# Altium project A540R260_PGA_ARM3_FPA.PrjPcb
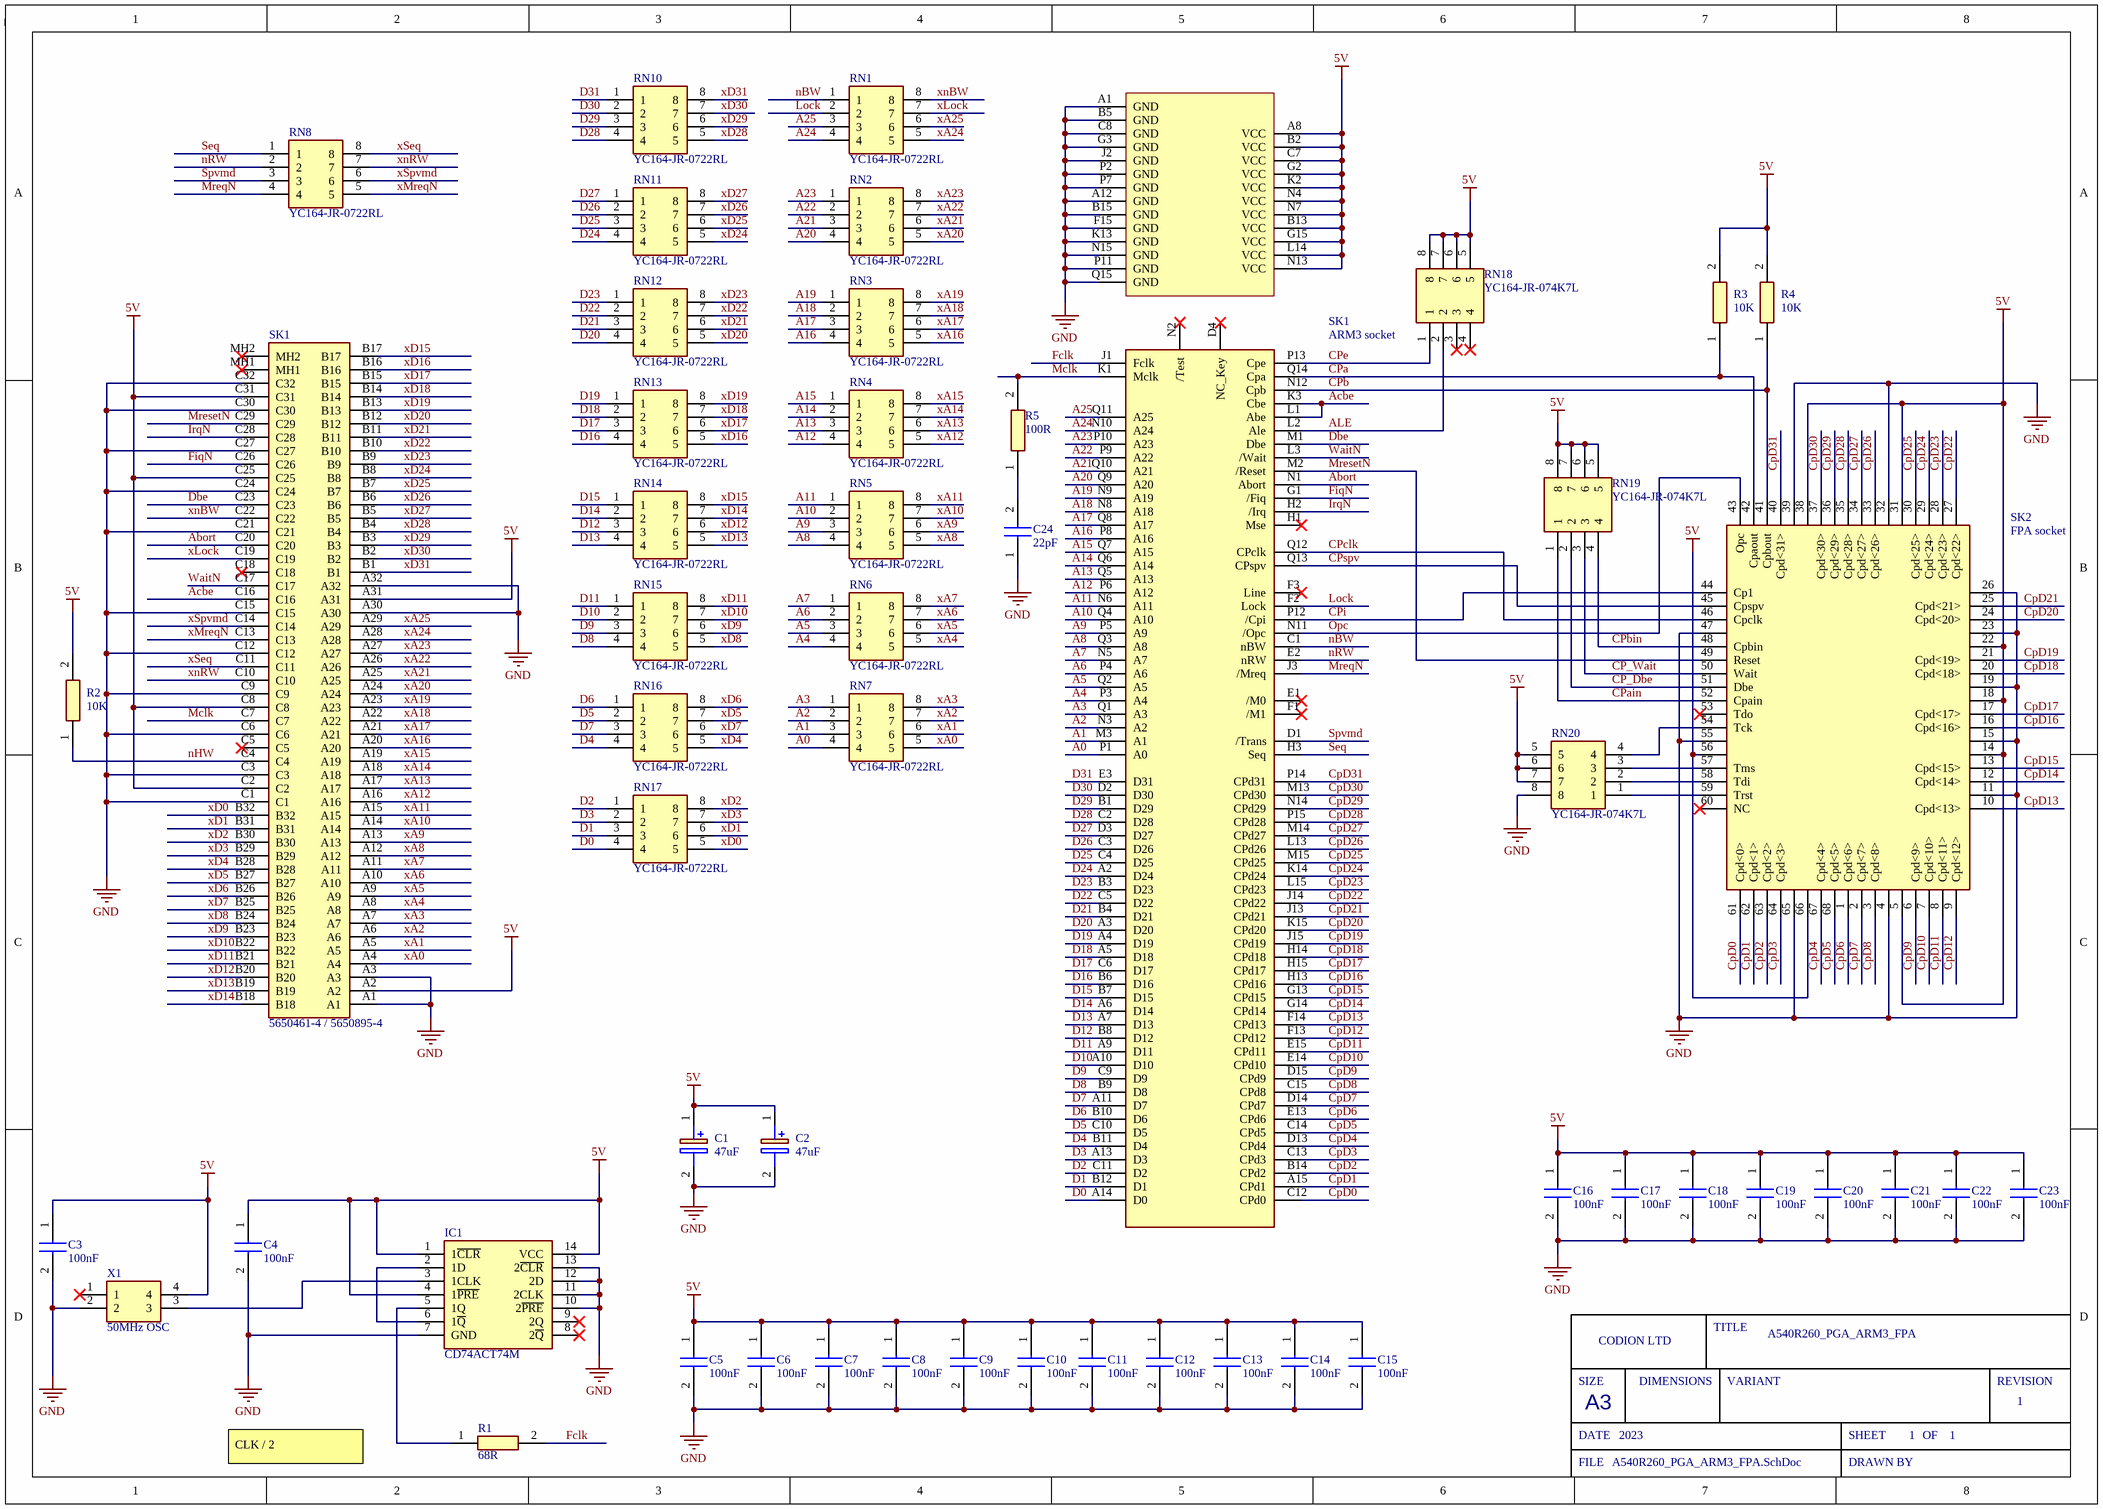
[diagram p0: A540R260_PGA_ARM3_FPA.SchDoc]
Project_Title: A540R260_PGA_ARM3_FPA; Sch_ReleaseDate: 2023; Sch_RevNo: 1
1 sheet, 53 parts. Net scope: global (net labels, ports and power ports of the same name join across sheets).
Board file: A540R260_PGA_ARM3_FPA.PcbDoc

## Sheet A540R260_PGA_ARM3_FPA.SchDoc
size A3; SheetNumber: 1; SheetTotal: 1

### Parts
(Parts that share a designator on the sheet are numbered #1, #2 ... from top to bottom, then left to right.)
C1  47uF  [EEE1AA101SP]
C2  47uF  [EEE1AA101SP]
C3  100nF  [CAPC2012X145N]
C4  100nF  [CAPC2012X145N]
C5  100nF  [CAPC2012X145N]
C6  100nF  [CAPC2012X145N]
C7  100nF  [CAPC2012X145N]
C8  100nF  [CAPC2012X145N]
C9  100nF  [CAPC2012X145N]
C10  100nF  [CAPC2012X145N]
C11  100nF  [CAPC2012X145N]
C12  100nF  [CAPC2012X145N]
C13  100nF  [CAPC2012X145N]
C14  100nF  [CAPC2012X145N]
C15  100nF  [CAPC2012X145N]
C16  100nF  [CAPC2012X145N]
C17  100nF  [CAPC2012X145N]
C18  100nF  [CAPC2012X145N]
C19  100nF  [CAPC2012X145N]
C20  100nF  [CAPC2012X145N]
C21  100nF  [CAPC2012X145N]
C22  100nF  [CAPC2012X145N]
C23  100nF  [CAPC2012X145N]
C24  22pF  [CAPC1608X90N]
IC1  CD74ACT74M  [SOIC127P600X175-14N]
R1  value 68R  [RESC2012X50N]  (hidden comment: CRCW080568R0FKEA)
R2  10K  [RESC2012X60N]
R3  10K  [RESC2012X60N]
R4  10K  [RESC2012X60N]
R5  100R  [RESC2012X60N]
RN1  YC164-JR-0722RL  [YC164JR072K2L]
RN2  YC164-JR-0722RL  [YC164JR072K2L]
RN3  YC164-JR-0722RL  [YC164JR072K2L]
RN4  YC164-JR-0722RL  [YC164JR072K2L]
RN5  YC164-JR-0722RL  [YC164JR072K2L]
RN6  YC164-JR-0722RL  [YC164JR072K2L]
RN7  YC164-JR-0722RL  [YC164JR072K2L]
RN8  YC164-JR-0722RL  [YC164JR072K2L]
RN10  YC164-JR-0722RL  [YC164JR072K2L]
RN11  YC164-JR-0722RL  [YC164JR072K2L]
RN12  YC164-JR-0722RL  [YC164JR072K2L]
RN13  YC164-JR-0722RL  [YC164JR072K2L]
RN14  YC164-JR-0722RL  [YC164JR072K2L]
RN15  YC164-JR-0722RL  [YC164JR072K2L]
RN16  YC164-JR-0722RL  [YC164JR072K2L]
RN17  YC164-JR-0722RL  [YC164JR072K2L]
RN18  YC164-JR-074K7L  [YC164JR07220RL]
RN19  YC164-JR-074K7L  [YC164JR07220RL]
RN20  YC164-JR-074K7L  [YC164JR07220RL]
SK1#1  ARM3 socket  [PGA_ARM3]
SK1#2  5650461-4 / 5650895-4  [56504614]
SK2  FPA socket  [MEMC_Socket]
X1  50MHz OSC  [DIPS762W56P1524L1778H241Q4N]

### Nets
5V: C1.1(+) C2.1(+) C3.1 C4.1 C5.1 C6.1 C7.1 C8.1 C9.1 C10.1 C11.1 C12.1 C13.1 C14.1 C15.1 C16.1 C17.1 C18.1 C19.1 C20.1 C21.1 C22.1 C23.1 IC1.1(1~{CLR}) IC1.4(1~{PRE}) IC1.14(VCC) R2.2 R3.2 R4.2 RN18.5 RN18.6 RN18.7 RN18.8 RN19.5 RN19.6 RN19.7 RN19.8 RN20.5 RN20.6 RN20.7 SK1#1.A8(VCC) SK1#1.B2(VCC) SK1#1.B13(VCC) SK1#1.C7(VCC) SK1#1.G2(VCC) SK1#1.G15(VCC) SK1#1.K2(VCC) SK1#1.L14(VCC) SK1#1.N4(VCC) SK1#1.N7(VCC) SK1#1.N13(VCC) SK1#2.A2 SK1#2.A31 SK1#2.C2 SK1#2.C8 SK1#2.C25 SK1#2.C31 SK2.5 SK2.14 SK2.18 SK2.22 SK2.31 SK2.38 SK2.56 SK2.66 X1.4
GND: C1.2(-) C2.2(-) C3.2 C4.2 C5.2 C6.2 C7.2 C8.2 C9.2 C10.2 C11.2 C12.2 C13.2 C14.2 C15.2 C16.2 C17.2 C18.2 C19.2 C20.2 C21.2 C22.2 C23.2 C24.1 IC1.7(GND) IC1.10(2~{PRE}) IC1.11(2CLK) IC1.12(2D) IC1.13(2~{CLR}) RN20.8 SK1#1.A1(GND) SK1#1.A12(GND) SK1#1.B5(GND) SK1#1.B15(GND) SK1#1.C8(GND) SK1#1.F15(GND) SK1#1.G3(GND) SK1#1.J2(GND) SK1#1.K13(GND) SK1#1.N15(GND) SK1#1.P2(GND) SK1#1.P7(GND) SK1#1.P11(GND) SK1#1.Q15(GND) SK1#2.A1 SK1#2.A3 SK1#2.A30 SK1#2.A32 SK1#2.C1 SK1#2.C3 SK1#2.C6 SK1#2.C9 SK1#2.C12 SK1#2.C15 SK1#2.C21 SK1#2.C24 SK1#2.C27 SK1#2.C30 SK1#2.C32 SK2.4 SK2.11 SK2.15 SK2.19 SK2.23 SK2.26 SK2.32 SK2.39 SK2.47 SK2.55 SK2.65 X1.2
A0: RN7.4 SK1#1.P1(A0)
A1: RN7.3 SK1#1.M3(A1)
A2: RN7.2 SK1#1.N3(A2)
A3: RN7.1 SK1#1.Q1(A3)
A4: RN6.4 SK1#1.P3(A4)
A5: RN6.3 SK1#1.Q2(A5)
A6: RN6.2 SK1#1.P4(A6)
A7: RN6.1 SK1#1.N5(A7)
A8: RN5.4 SK1#1.Q3(A8)
A9: RN5.3 SK1#1.P5(A9)
A10: RN5.2 SK1#1.Q4(A10)
A11: RN5.1 SK1#1.N6(A11)
A12: RN4.4 SK1#1.P6(A12)
A13: RN4.3 SK1#1.Q5(A13)
A14: RN4.2 SK1#1.Q6(A14)
A15: RN4.1 SK1#1.Q7(A15)
A16: RN3.4 SK1#1.P8(A16)
A17: RN3.3 SK1#1.Q8(A17)
A18: RN3.2 SK1#1.N8(A18)
A19: RN3.1 SK1#1.N9(A19)
A20: RN2.4 SK1#1.Q9(A20)
A21: RN2.3 SK1#1.Q10(A21)
A22: RN2.2 SK1#1.P9(A22)
A23: RN2.1 SK1#1.P10(A23)
A24: RN1.4 SK1#1.N10(A24)
A25: RN1.3 SK1#1.Q11(A25)
Abort: SK1#1.N1(Abort) SK1#2.C20
Acbe: SK1#1.K3(Cbe) SK1#1.L1(Abe) SK1#2.C16
ALE: RN18.2 SK1#1.L2(Ale)
CP_Dbe: RN19.2 SK2.51(Dbe)
CP_Wait: RN19.3 SK2.50(Wait)
CPa: R3.1 SK1#1.Q14(Cpa) SK2.42(Cpaout)
CPain: RN19.1 SK2.52(Cpain)
CPb: R4.1 SK1#1.N12(Cpb) SK2.41(Cpbout)
CPbin: RN19.4 SK2.48(Cpbin)
CPclk: SK1#1.Q12(CPclk) SK2.46(Cpclk)
CpD0: SK1#1.C12(CPd0) SK2.61(Cpd<0>)
CpD1: SK1#1.A15(CPd1) SK2.62(Cpd<1>)
CpD2: SK1#1.B14(CPd2) SK2.63(Cpd<2>)
CpD3: SK1#1.C13(CPd3) SK2.64(Cpd<3>)
CpD4: SK1#1.D13(CPd4) SK2.67(Cpd<4>)
CpD5: SK1#1.C14(CPd5) SK2.68(Cpd<5>)
CpD6: SK1#1.E13(CPd6) SK2.1(Cpd<6>)
CpD7: SK1#1.D14(CPd7) SK2.2(Cpd<7>)
CpD8: SK1#1.C15(CPd8) SK2.3(Cpd<8>)
CpD9: SK1#1.D15(CPd9) SK2.6(Cpd<9>)
CpD10: SK1#1.E14(CPd10) SK2.7(Cpd<10>)
CpD11: SK1#1.E15(CPd11) SK2.8(Cpd<11>)
CpD12: SK1#1.F13(CPd12) SK2.9(Cpd<12>)
CpD13: SK1#1.F14(CPd13) SK2.10(Cpd<13>)
CpD14: SK1#1.G14(CPd14) SK2.12(Cpd<14>)
CpD15: SK1#1.G13(CPd15) SK2.13(Cpd<15>)
CpD16: SK1#1.H13(CPd16) SK2.16(Cpd<16>)
CpD17: SK1#1.H15(CPd17) SK2.17(Cpd<17>)
CpD18: SK1#1.H14(CPd18) SK2.20(Cpd<18>)
CpD19: SK1#1.J15(CPd19) SK2.21(Cpd<19>)
CpD20: SK1#1.K15(CPd20) SK2.24(Cpd<20>)
CpD21: SK1#1.J13(CPd21) SK2.25(Cpd<21>)
CpD22: SK1#1.J14(CPd22) SK2.27(Cpd<22>)
CpD23: SK1#1.L15(CPd23) SK2.28(Cpd<23>)
CpD24: SK1#1.K14(CPd24) SK2.29(Cpd<24>)
CpD25: SK1#1.M15(CPd25) SK2.30(Cpd<25>)
CpD26: SK1#1.L13(CPd26) SK2.33(Cpd<26>)
CpD27: SK1#1.M14(CPd27) SK2.34(Cpd<27>)
CpD28: SK1#1.P15(CPd28) SK2.35(Cpd<28>)
CpD29: SK1#1.N14(CPd29) SK2.36(Cpd<29>)
CpD30: SK1#1.M13(CPd30) SK2.37(Cpd<30>)
CpD31: SK1#1.P14(CPd31) SK2.40(Cpd<31>)
CPe: RN18.1 SK1#1.P13(Cpe)
CPi: SK1#1.P12(/Cpi) SK2.44(Cp1)
CPspv: SK1#1.Q13(CPspv) SK2.45(Cpspv)
D0: RN17.4 SK1#1.A14(D0)
D1: RN17.3 SK1#1.B12(D1)
D2: RN17.1 SK1#1.C11(D2)
D3: RN17.2 SK1#1.A13(D3)
D4: RN16.4 SK1#1.B11(D4)
D5: RN16.2 SK1#1.C10(D5)
D6: RN16.1 SK1#1.B10(D6)
D7: RN16.3 SK1#1.A11(D7)
D8: RN15.4 SK1#1.B9(D8)
D9: RN15.3 SK1#1.C9(D9)
D10: RN15.2 SK1#1.A10(D10)
D11: RN15.1 SK1#1.A9(D11)
D12: RN14.3 SK1#1.B8(D12)
D13: RN14.4 SK1#1.A7(D13)
D14: RN14.2 SK1#1.A6(D14)
D15: RN14.1 SK1#1.B7(D15)
D16: RN13.4 SK1#1.B6(D16)
D17: RN13.3 SK1#1.C6(D17)
D18: RN13.2 SK1#1.A5(D18)
D19: RN13.1 SK1#1.A4(D19)
D20: RN12.4 SK1#1.A3(D20)
D21: RN12.3 SK1#1.B4(D21)
D22: RN12.2 SK1#1.C5(D22)
D23: RN12.1 SK1#1.B3(D23)
D24: RN11.4 SK1#1.A2(D24)
D25: RN11.3 SK1#1.C4(D25)
D26: RN11.2 SK1#1.C3(D26)
D27: RN11.1 SK1#1.D3(D27)
D28: RN10.4 SK1#1.C2(D28)
D29: RN10.3 SK1#1.B1(D29)
D30: RN10.2 SK1#1.D2(D30)
D31: RN10.1 SK1#1.E3(D31)
Dbe: SK1#1.M1(Dbe) SK1#2.C23
Fclk: R1.2 SK1#1.J1(Fclk)
FiqN: SK1#1.G1(/Fiq) SK1#2.C26
IrqN: SK1#1.H2(/Irq) SK1#2.C28
Lock: RN1.2 SK1#1.F2(Lock)
Mclk: R5.2 SK1#1.K1(Mclk) SK1#2.C7
MreqN: RN8.4 SK1#1.J3(/Mreq)
MresetN: SK1#1.M2(/Reset) SK1#2.C29 SK2.49(Reset)
nBW: RN1.1 SK1#1.C1(nBW)
nHW: R2.1 SK1#2.C4
nRW: RN8.2 SK1#1.E2(nRW)
Opc: SK1#1.N11(/Opc) SK2.43(Opc)
Seq: RN8.1 SK1#1.H3(Seq)
Spvmd: RN8.3 SK1#1.D1(/Trans)
WaitN: SK1#1.L3(/Wait) SK1#2.C17
xA0: RN7.5 SK1#2.A4
xA1: RN7.6 SK1#2.A5
xA2: RN7.7 SK1#2.A6
xA3: RN7.8 SK1#2.A7
xA4: RN6.5 SK1#2.A8
xA5: RN6.6 SK1#2.A9
xA6: RN6.7 SK1#2.A10
xA7: RN6.8 SK1#2.A11
xA8: RN5.5 SK1#2.A12
xA9: RN5.6 SK1#2.A13
xA10: RN5.7 SK1#2.A14
xA11: RN5.8 SK1#2.A15
xA12: RN4.5 SK1#2.A16
xA13: RN4.6 SK1#2.A17
xA14: RN4.7 SK1#2.A18
xA15: RN4.8 SK1#2.A19
xA16: RN3.5 SK1#2.A20
xA17: RN3.6 SK1#2.A21
xA18: RN3.7 SK1#2.A22
xA19: RN3.8 SK1#2.A23
xA20: RN2.5 SK1#2.A24
xA21: RN2.6 SK1#2.A25
xA22: RN2.7 SK1#2.A26
xA23: RN2.8 SK1#2.A27
xA24: RN1.5 SK1#2.A28
xA25: RN1.6 SK1#2.A29
xD0: RN17.5 SK1#2.B32
xD1: RN17.6 SK1#2.B31
xD2: RN17.8 SK1#2.B30
xD3: RN17.7 SK1#2.B29
xD4: RN16.5 SK1#2.B28
xD5: RN16.7 SK1#2.B27
xD6: RN16.8 SK1#2.B26
xD7: RN16.6 SK1#2.B25
xD8: RN15.5 SK1#2.B24
xD9: RN15.6 SK1#2.B23
xD10: RN15.7 SK1#2.B22
xD11: RN15.8 SK1#2.B21
xD12: RN14.6 SK1#2.B20
xD13: RN14.5 SK1#2.B19
xD14: RN14.7 SK1#2.B18
xD15: RN14.8 SK1#2.B17
xD16: RN13.5 SK1#2.B16
xD17: RN13.6 SK1#2.B15
xD18: RN13.7 SK1#2.B14
xD19: RN13.8 SK1#2.B13
xD20: RN12.5 SK1#2.B12
xD21: RN12.6 SK1#2.B11
xD22: RN12.7 SK1#2.B10
xD23: RN12.8 SK1#2.B9
xD24: RN11.5 SK1#2.B8
xD25: RN11.6 SK1#2.B7
xD26: RN11.7 SK1#2.B6
xD27: RN11.8 SK1#2.B5
xD28: RN10.5 SK1#2.B4
xD29: RN10.6 SK1#2.B3
xD30: RN10.7 SK1#2.B2
xD31: RN10.8 SK1#2.B1
xLock: RN1.7 SK1#2.C19
xMreqN: RN8.5 SK1#2.C13
xnBW: RN1.8 SK1#2.C22
xnRW: RN8.7 SK1#2.C10
xSeq: RN8.8 SK1#2.C11
xSpvmd: RN8.6 SK1#2.C14
NetC24_2: C24.2 R5.1
NetIC1_2: IC1.2(1D) IC1.6(1~{Q})
NetIC1_3: IC1.3(1CLK) X1.3
NetIC1_5: IC1.5(1Q) R1.1
NetRN20_1: RN20.1 SK2.59(Trst)
NetRN20_2: RN20.2 SK2.58(Tdi)
NetRN20_3: RN20.3 SK2.57(Tms)
NetRN20_4: RN20.4 SK2.54(Tck)

Not connected (* = marked no-connect by the designer): IC1 8(2~{Q})* 9(2Q)*; RN18 3* 4*; SK1#1 D4(NC_Key)* E1(/M0)* F1(/M1)* F3(Line)* H1(Mse)* N2(/Test)*; SK1#2 C5* C18* MH1* MH2*; SK2 53(Tdo)* 60(NC)*; X1 1*

### Notes on the sheet
- CLK / 2
- SIZE
- CODION LTD
- DIMENSIONS
- TITLE
- VARIANT
- REVISION
- DATE
- A3
- SHEET
- OF
- FILE
- DRAWN BY

### Library data of the parts
C1 C2 = EEE1VA470WP: Capacitor Polarised; Manufacturer_Name: Panasonic; Datasheet Link: http://industrial.panasonic.com/cdbs/www-data/pdf/RDE0000/ABA0000C1145.pdf; Height: 7.8mm; Manufacturer_Part_Number: EEE1VA470WP
C3-C23 = C2012X7R1H104K125AM: Capacitor; Manufacturer_Name: TDK; Datasheet Link: https://product.tdk.com/info/en/catalog/datasheets/mlcc_commercial_midvoltage_en.pdf; Height: 1.45mm; Manufacturer_Part_Number: C2012X7R1H104K125AM; Mouser Part Number: 810-C2012X7R1H104KT5; Mouser Price/Stock: https://www.mouser.com/Search/Refine.aspx?Keyword=810-C2012X7R1H104KT5; Arrow Part Number: C2012X7R1H104K125AM; Arrow Price/Stock: https://www.arrow.com/en/products/c2012x7r1h104k125am/tdk
C24 = CGA3E2NP02A220J080AA: Capacitor; Manufacturer_Name: TDK; Datasheet Link: http://docs-europe.electrocomponents.com/webdocs/14e9/0900766b814e9125.pdf; Height: 0.9mm; Manufacturer_Part_Number: CGA3E2NP02A220J080AA; Mouser Part Number: 810-CGA3E2NP02A220JA
IC1 = CD74ACT74M: Integrated Circuit; Manufacturer_Name: Texas Instruments; Datasheet Link: http://www.ti.com/lit/ds/symlink/cd74act74.pdf; Height: 1.75mm; Manufacturer_Part_Number: CD74ACT74M; Mouser Part Number: 595-CD74ACT74M; Mouser Price/Stock: https://www.mouser.com/Search/Refine.aspx?Keyword=595-CD74ACT74M
R1 = CRCW080568R0FKEA: 68R Resistor; Manufacturer_Name: Vishay; Datasheet Link: http://www.vishay.com/docs/20035/dcrcwe3.pdf; Height: 0.5mm; Manufacturer_Part_Number: CRCW080568R0FKEA; Mouser Part Number: 71-CRCW080568R0FKEA; Mouser Price/Stock: https://www.mouser.com/Search/Refine.aspx?Keyword=71-CRCW080568R0FKEA; Arrow Part Number: CRCW080568R0FKEA; Arrow Price/Stock: https://www.arrow.com/en/products/crcw080568r0fkea/vishay
R2-R4 = RC0805JR-0710KL: Resistor; Manufacturer_Name: KEMET; Datasheet Link: https://datasheet.datasheetarchive.com/originals/distributors/Datasheets_SAMA/902f9e387b938f871d31120f5fc1d65e.pdf; Height: 0.6mm; Manufacturer_Part_Number: RC0805JR-0710KL; Mouser Part Number: 603-RC0805JR-0710KL; Mouser Price/Stock: https://www.mouser.co.uk/ProductDetail/YAGEO/RC0805JR-0710KL?qs=ZFGQJeMQzF5q%2Fp77vM%2FrVQ%3D%3D; Arrow Part Number: RC0805JR-0710KL; Arrow Price/Stock: https://www.arrow.com/en/products/rc0805jr-0710kl/yageo
R5 = CRCW0805100RFKEAC: Resistor; Manufacturer_Name: Vishay; Datasheet Link: https://componentsearchengine.com/Datasheets/1/CRCW0805100RFKEAC.pdf; Height: 0.6mm; Manufacturer_Part_Number: CRCW0805100RFKEAC; Mouser Part Number: 71-CRCW0805100RFKEAC; Mouser Price/Stock: https://www.mouser.co.uk/ProductDetail/Vishay-Dale/CRCW0805100RFKEAC?qs=E3Y5ESvWgWM6LN%2Fsc41QGg%3D%3D; Arrow Part Number: CRCW0805100RFKEAC; Arrow Price/Stock: https://www.arrow.com/en/products/crcw0805100rfkeac/vishay?region=nac
RN1-RN8 RN10-RN17 = YC164-JR-0722RL: Resistor Network; Manufacturer_Name: KEMET; Datasheet Link: https://componentsearchengine.com/Datasheets/2/YC164-JR-072K2L.pdf; Height: 0.7mm; Manufacturer_Part_Number: YC164-JR-0722RL; Mouser Part Number: 603-YC164-JR-0722RL; Mouser Price/Stock: https://www.mouser.co.uk/ProductDetail/YAGEO/YC164-JR-0722RL?qs=PUN631quMycSauRlrBstDw%3D%3D; Arrow Part Number: YC164-JR-0722RL; Arrow Price/Stock: https://www.arrow.com/en/products/yc164-jr-0722rl/yageo
RN18-RN20 = YC164-JR-074K7L: Resistor Network; Manufacturer_Name: KEMET; Datasheet Link: https://media.digikey.com/pdf/Data%20Sheets/Yageo%20PDFs/YC102-358,TC122-164_Series_DS.pdf; Height: 0mm; Manufacturer_Part_Number: YC164-JR-074K7L; Mouser Part Number: 603-YC164-JR-074K7L; Mouser Price/Stock: https://www.mouser.co.uk/ProductDetail/YAGEO/YC164-JR-074K7L?qs=R3r%2F0p8sX68YCHdOvgl0Gg%3D%3D; Arrow Part Number: YC164-JR-074K7L; Arrow Price/Stock: https://www.arrow.com/en/products/yc164-jr-074k7l/yageo?region=nac
SK1#1 = PGA_ARM3: ARM3
SK1#2 = 5650461-4: Connector; Manufacturer_Name: TE Connectivity; Datasheet Link: https://componentsearchengine.com/Datasheets/2/5650461-4.pdf; Height: 10.49mm; Manufacturer_Part_Number: 5650461-4; Mouser Part Number: 571-5650461-4; Mouser Price/Stock: https://www.mouser.co.uk/ProductDetail/TE-Connectivity/5650461-4?qs=xrnNvQC1SKQ%2FjdFwmiH0Uw%3D%3D; Arrow Part Number: 5650461-4; Arrow Price/Stock: https://www.arrow.com/en/products/5650461-4/te-connectivity
SK2 = FPA_SKT: Manufacturer_Name: 3M; Manufacturer_Part_Number: 8468-21B1-RK-TR; Datasheet Link: https://www.arrow.com/en/products/8468-21b1-rk-tr/3m; Height: 4.6mm; Mouser Part Number: 517-8468-21B1-RK-TR; Mouser Price/Stock: https://www.mouser.co.uk/ProductDetail/3M-Electronic-Solutions-Division/8468-21B1-RK-TR?qs=X%2F%2F06fXhnJ18zOj3KK47CQ%3D%3D; Arrow Part Number: 8468-21B1-RK-TR; Arrow Price/Stock: https://www.arrow.com/en/products/8468-21b1-rk-tr/3m
X1 = 1107741: Manufacturer_Name: ARIES; Datasheet Link: http://docs-emea.rs-online.com/webdocs/13f3/0900766b813f3237.pdf; Height: 2.41mm; Manufacturer_Part_Number: 1107741; Mouser Part Number: 535-1107741; Mouser Price/Stock: https://www.mouser.co.uk/ProductDetail/Aries-Electronics/1107741?qs=WZRMhwwaLl%2FApwqojhfzdA%3D%3D